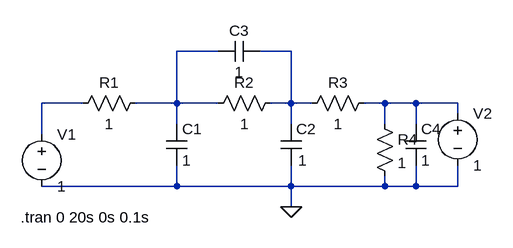
[diagram p0: schematic Q2d.asc]
Q2d.asc, the LTspice schematic file:
Version 4
SHEET 1 880 680
WIRE 128 -160 64 -160
WIRE 240 -160 192 -160
WIRE -80 -80 -144 -80
WIRE 64 -80 64 -160
WIRE 64 -80 0 -80
WIRE 128 -80 64 -80
WIRE 240 -80 240 -160
WIRE 240 -80 208 -80
WIRE 272 -80 240 -80
WIRE 384 -80 352 -80
WIRE 432 -80 384 -80
WIRE 496 -80 432 -80
WIRE 496 -64 496 -80
WIRE 64 -48 64 -80
WIRE 240 -48 240 -80
WIRE 384 -48 384 -80
WIRE 432 -48 432 -80
WIRE -144 -32 -144 -80
WIRE 64 48 64 16
WIRE 64 48 -144 48
WIRE 240 48 240 16
WIRE 240 48 64 48
WIRE 384 48 384 32
WIRE 384 48 240 48
WIRE 432 48 432 16
WIRE 432 48 384 48
WIRE 496 48 496 16
WIRE 496 48 432 48
WIRE 240 80 240 48
FLAG 240 80 0
SYMBOL cap 48 -48 R0
SYMATTR InstName C1
SYMATTR Value 1
SYMBOL res -96 -64 R270
WINDOW 0 32 56 VTop 2
WINDOW 3 0 56 VBottom 2
SYMATTR InstName R1
SYMATTR Value 1
SYMBOL voltage -144 -48 R0
WINDOW 123 0 0 Left 0
WINDOW 39 24 124 Left 2
SYMATTR InstName V1
SYMATTR Value 1
SYMBOL voltage 496 -80 R0
WINDOW 123 0 0 Left 0
WINDOW 39 24 124 Left 2
SYMATTR InstName V2
SYMATTR Value 1
SYMBOL res 112 -64 R270
WINDOW 0 32 56 VTop 2
WINDOW 3 0 56 VBottom 2
SYMATTR InstName R2
SYMATTR Value 1
SYMBOL res 368 -96 R90
WINDOW 0 0 56 VBottom 2
WINDOW 3 32 56 VTop 2
SYMATTR InstName R3
SYMATTR Value 1
SYMBOL cap 224 -48 R0
WINDOW 3 27 56 Left 2
SYMATTR Value 1
SYMATTR InstName C2
SYMBOL cap 192 -176 R90
WINDOW 0 0 32 VBottom 2
WINDOW 3 32 32 VTop 2
SYMATTR InstName C3
SYMATTR Value 1
SYMBOL res 368 -64 R0
SYMATTR InstName R4
SYMATTR Value 1
SYMBOL cap 416 -48 R0
SYMATTR InstName C4
SYMATTR Value 1
TEXT -176 96 Left 2 !.tran 0 20s 0s 0.1s

The netlist it stands for:
* Q2d.asc
C1 N001 0 1
R1 N003 N001 1
V1 N003 0 1
V2 N004 0 1
R2 N001 N002 1
R3 N004 N002 1
C2 N002 0 1
C3 N002 N001 1
R4 N004 0 1
C4 N004 0 1
.tran 0 20s 0s 0.1s
.backanno
.end